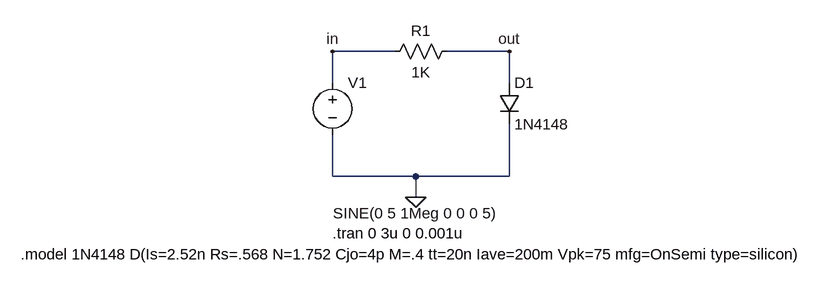
[diagram p0: schematic 3_Senoidal_Response_Diodo_PN_1n4148.asc]
3_Senoidal_Response_Diodo_PN_1n4148.asc, the LTspice schematic file:
Version 4
SHEET 1 1028 680
WIRE 208 32 112 32
WIRE 384 32 288 32
WIRE 112 80 112 32
WIRE 384 80 384 32
WIRE 112 224 112 160
WIRE 240 224 112 224
WIRE 384 224 384 144
WIRE 384 224 240 224
WIRE 240 256 240 224
FLAG 240 256 0
FLAG 112 32 in
FLAG 384 32 out
SYMBOL voltage 112 64 R0
WINDOW 3 1 217 Left 2
WINDOW 123 0 0 Left 0
WINDOW 39 0 0 Left 0
SYMATTR InstName V1
SYMATTR Value SINE(0 5 1Meg 0 0 0 5)
SYMBOL res 304 16 R90
WINDOW 0 0 56 VBottom 2
WINDOW 3 32 56 VTop 2
SYMATTR InstName R1
SYMATTR Value 1K
SYMBOL diode 368 80 R0
SYMATTR InstName D1
SYMATTR Value 1N4148
TEXT 112 312 Left 2 !.tran 0 3u 0 0.001u
TEXT -368 344 Left 2 !.model 1N4148 D(Is=2.52n Rs=.568 N=1.752 Cjo=4p M=.4 tt=20n Iave=200m Vpk=75 mfg=OnSemi type=silicon)

The netlist it stands for:
* 3_Senoidal_Response_Diodo_PN_1n4148.asc
V1 in 0 SINE(0 5 1Meg 0 0 0 5)
R1 out in 1K
D1 out 0 1N4148
.model D D
.lib standard.dio
.tran 0 3u 0 0.001u
.model 1N4148 D(Is=2.52n Rs=.568 N=1.752 Cjo=4p M=.4 tt=20n Iave=200m Vpk=75 mfg=OnSemi type=silicon)
.backanno
.end

* Results of the author's LTspice run, read from the files saved beside the schematic
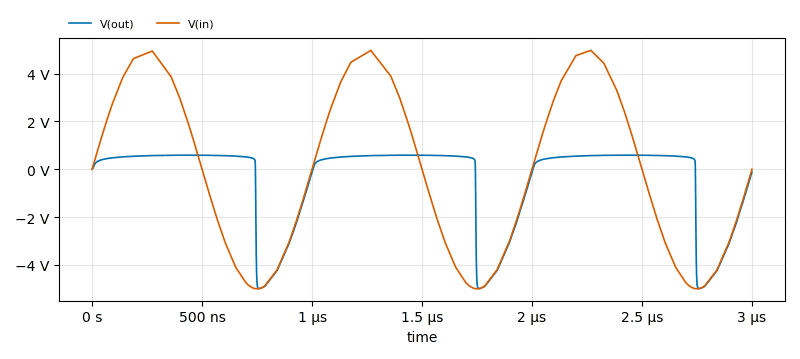
[diagram p1: Transient Analysis of 3_Senoidal_Response_Diodo_PN_1n4148.asc, plotted from the saved traces]
* Transient Analysis, 1 run:
*   V(out): min -4.993 V, max 588.3 mV, average -431.9 mV, rms 1.862 V, last -116 mV
*   V(in): min -5 V, max 4.971 V, average -14.09 mV, rms 3.513 V, last 0 V